# Altium project DAQ_REV_B2.PrjPcb (part 2 of 2)

## Sheet Cover_sheet.SchDoc: Cover Sheet
size A4; Date: 23.10.2016; DrawnBy: Matjaz Tome; Engineer: Matjaz Tome; DocumentNumber: 1; Revision: B1; SheetNumber: 1; SheetTotal: 8; Project: USB DAQ
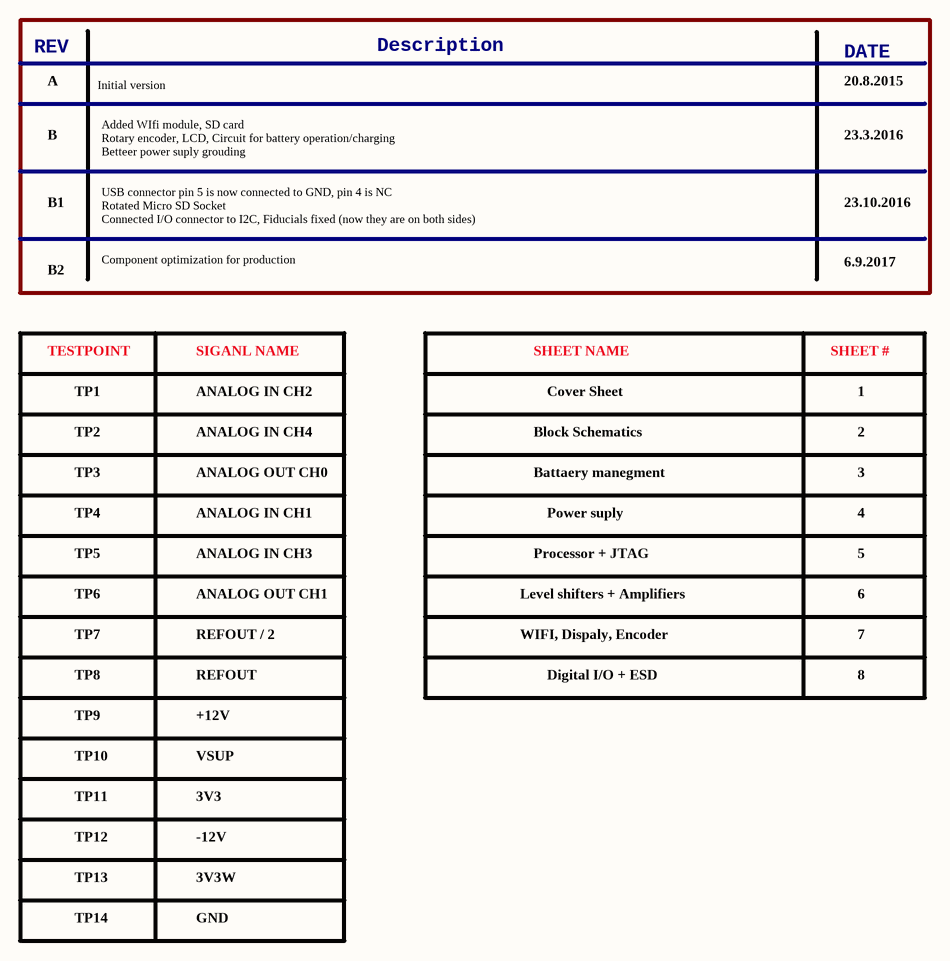
[diagram p7: Cover_sheet.SchDoc]

### Notes on the sheet
- REV
- Description
- DATE
- A
- Initial version
- 20.8.2015
- B
- Added WIfi module, SD card
  Rotary encoder, LCD, Circuit for battery operation/charging
  Betteer power suply grouding
- 23.3.2016
- B1
- USB connector pin 5 is now connected to GND, pin 4 is NC
  Rotated Micro SD Socket
  Connected I/O connector to I2C, Fiducials fixed (now they are on both sides)
- 23.10.2016
- 6.9.2017
- B2
- Component optimization for production
- TESTPOINT
- TP1
- SIGANL NAME
- ANALOG IN CH2
- SHEET NAME
- Cover Sheet
- SHEET #
- 1
- TP2
- ANALOG IN CH4
- Block Schematics
- 2
- TP3
- TP4
- ANALOG IN CH1
- ANALOG OUT CH0
- Battaery manegment
- Power suply
- 3
- 4
- TP5
- TP6
- ANALOG IN CH3
- ANALOG OUT CH1
- Level shifters + Amplifiers
- Processor + JTAG
- 5
- 6
- TP7
- REFOUT / 2
- WIFI, Dispaly, Encoder
- 7
- TP8
- TP9
- REFOUT
- +12V
- Digital I/O + ESD
- 8
- TP10
- TP11
- VSUP
- 3V3
- TP12
- -12V
- TP13
- TP14
- 3V3W
- GND
- Title
- Date
- Project
- Rev
- Engineer
- Sheet
- of

## Nets that join several sheets
3V3: Processor (J3.1 R49.2 R50.2 SB1.2), IO (J1.25), Power_suply (11 pins), WIFI_Display (5 pins)
3V3A: Analog (6 pins), Power_suply (C22.2 C35.1 L4.2 U12.7)
3V3W: Power_suply (C56.2 C57.1 TP13.1 U14.5), WIFI_Display (5 pins)
5VUSB: IO (F1.2), Battery_manegment (C51.2 R58.1 U13.5 U13.13)
+12V: Analog (C2.1 U2.8), IO (J1.1), Power_suply (C17.1 L1.2 TP9.1)
-12V: Analog (C3.2 U2.4), IO (J1.2), Power_suply (C32.1 L6.2 TP12.1)
AGND: Analog (6 pins), IO (11 pins), Power_suply (C17.2 C32.2 C40.1 L8.2)
GND: Processor (9 pins), Analog (13 pins), IO (C14.1 J2.5 R42.1), Power_suply (49 pins), Battery_manegment (12 pins), WIFI_Display (18 pins)
VSUP: IO (J1.5), Power_suply (15 pins), Battery_manegment (5 pins)
VSUPA: Analog (C1.1 U1.4), Power_suply (C40.2 L7.2)
ANALOG_OUT_0: Analog (R12.2 TP3.1 U2.1), IO (J1.34)
ANALOG_OUT_1: Analog (R25.1 TP6.1 U2.7), IO (J1.32)
BTN_0: Battery_manegment (D3.2 R53.1), WIFI_Display (R62.2)
BTN_IN: Processor (U12.44), Battery_manegment (R53.2)
CHG_EN: Processor (R51.2 SB1.1 U12.55), Battery_manegment (U13.4)
DAC_OUT_0: Processor (U12.59), Analog (R20.1)
DAC_OUT_1: Processor (U12.63), Analog (R28.1)
ENC_A: Processor (U12.23), WIFI_Display (R61.1)
ENC_B: Processor (U12.25), WIFI_Display (R64.1)
HV_ENABLE: Processor (U12.47), Power_suply (U10.3)
JTAG_TDO: Processor (J3.6 U12.49), WIFI_Display (Q2.1 R54.2)
LED_in: IO (R60.2), WIFI_Display (Q2.3 R59.1)
PIO0: Processor (U12.30), IO (R32.1 U6.6)
PIO1: Processor (U12.29), IO (R33.2 U6.4)
PIO2: Processor (U12.28), IO (R34.1 U6.3)
PIO3: Processor (U12.27), IO (R35.2 U6.1)
PIO4: Processor (U12.22), IO (R36.1 U7.6)
PIO5: Processor (U12.21), IO (R37.2 U7.4)
PIO6: Processor (U12.20), IO (R38.1 U7.3)
PIO7: Processor (U12.19), IO (R39.2 U7.1)
POWER_HOLD: Processor (U12.48), Battery_manegment (R52.1)
REF_OUT: Processor (L9.2), Analog (5 pins)
REF_OUT/2: Processor (U12.4 U12.6 U12.10 U12.16), Analog (9 pins)
SCL: Processor (R50.1 U12.36), IO (J1.3), WIFI_Display (U15.3)
SD_CLK: Processor (U12.41), WIFI_Display (R72.1)
SD_CMD: Processor (U12.38), WIFI_Display (R71.1)
SD_D0: Processor (U12.42), WIFI_Display (R73.1)
SD_D1: Processor (U12.52), WIFI_Display (R67.1)
SD_D2: Processor (U12.26), WIFI_Display (R66.1)
SD_D3: Processor (U12.37), WIFI_Display (R70.1)
SDA: Processor (R49.1 U12.43), IO (J1.4), WIFI_Display (U15.4)
UART_0_RX: Processor (U12.35), WIFI_Display (U16.2)
UART_0_TX: Processor (U12.34), WIFI_Display (U16.7)
USB_N: Processor (U12.56), IO (R40.2 U5.4)
USB_P: Processor (U12.57), IO (R41.2 U5.6)
V1_IN_N: Analog (R19.1), IO (J1.23)
V1_IN_P: Analog (R14.1), IO (J1.24)
V1_P: Processor (U12.3), Analog (C6.2 R15.2 TP4.1)
V2_IN_N: Analog (R7.1), IO (J1.21)
V2_IN_P: Analog (R3.1), IO (J1.22)
V2_P: Processor (U12.5), Analog (C4.2 R5.2 TP1.1)
V3_IN_N: Analog (R21.1), IO (J1.19)
V3_IN_P: Analog (R16.1), IO (J1.20)
V3_P: Processor (U12.9), Analog (C7.2 R18.2 TP5.1)
V4_IN_N: Analog (R8.1), IO (J1.17)
V4_IN_P: Analog (R4.1), IO (J1.18)
V4_P: Processor (U12.13), Analog (C5.2 R6.2 TP2.1)
V_BAT_IN: Processor (U12.11), Power_suply (R46.1 R47.2)
VBAT_EN: Processor (U12.14), Power_suply (Q1.1 R48.2)
WIFI_EN: Processor (U12.15), Power_suply (U14.3)

## Assembly variants
DAQ_DATA_LOGGER: not fitted R58
DAQ: not fitted C49 C50 C51 C52 C53 C55 C56 C57 C58 C59 C60 C61 C62 C63 D3 E1 J4 J5 Q1 R46 R47 R48 R49 R50 R51 R52 R53 R55 R56 R57 R61 R62 R64 R65 R66 R67 R68 R70 R71 R72 R73 U13 U14 U15 U16 Y2; alternate parts U9 -> XLR0005